# Altium project LimeSDR-XTRX_1v2.PrjPcb (part 5 of 9)
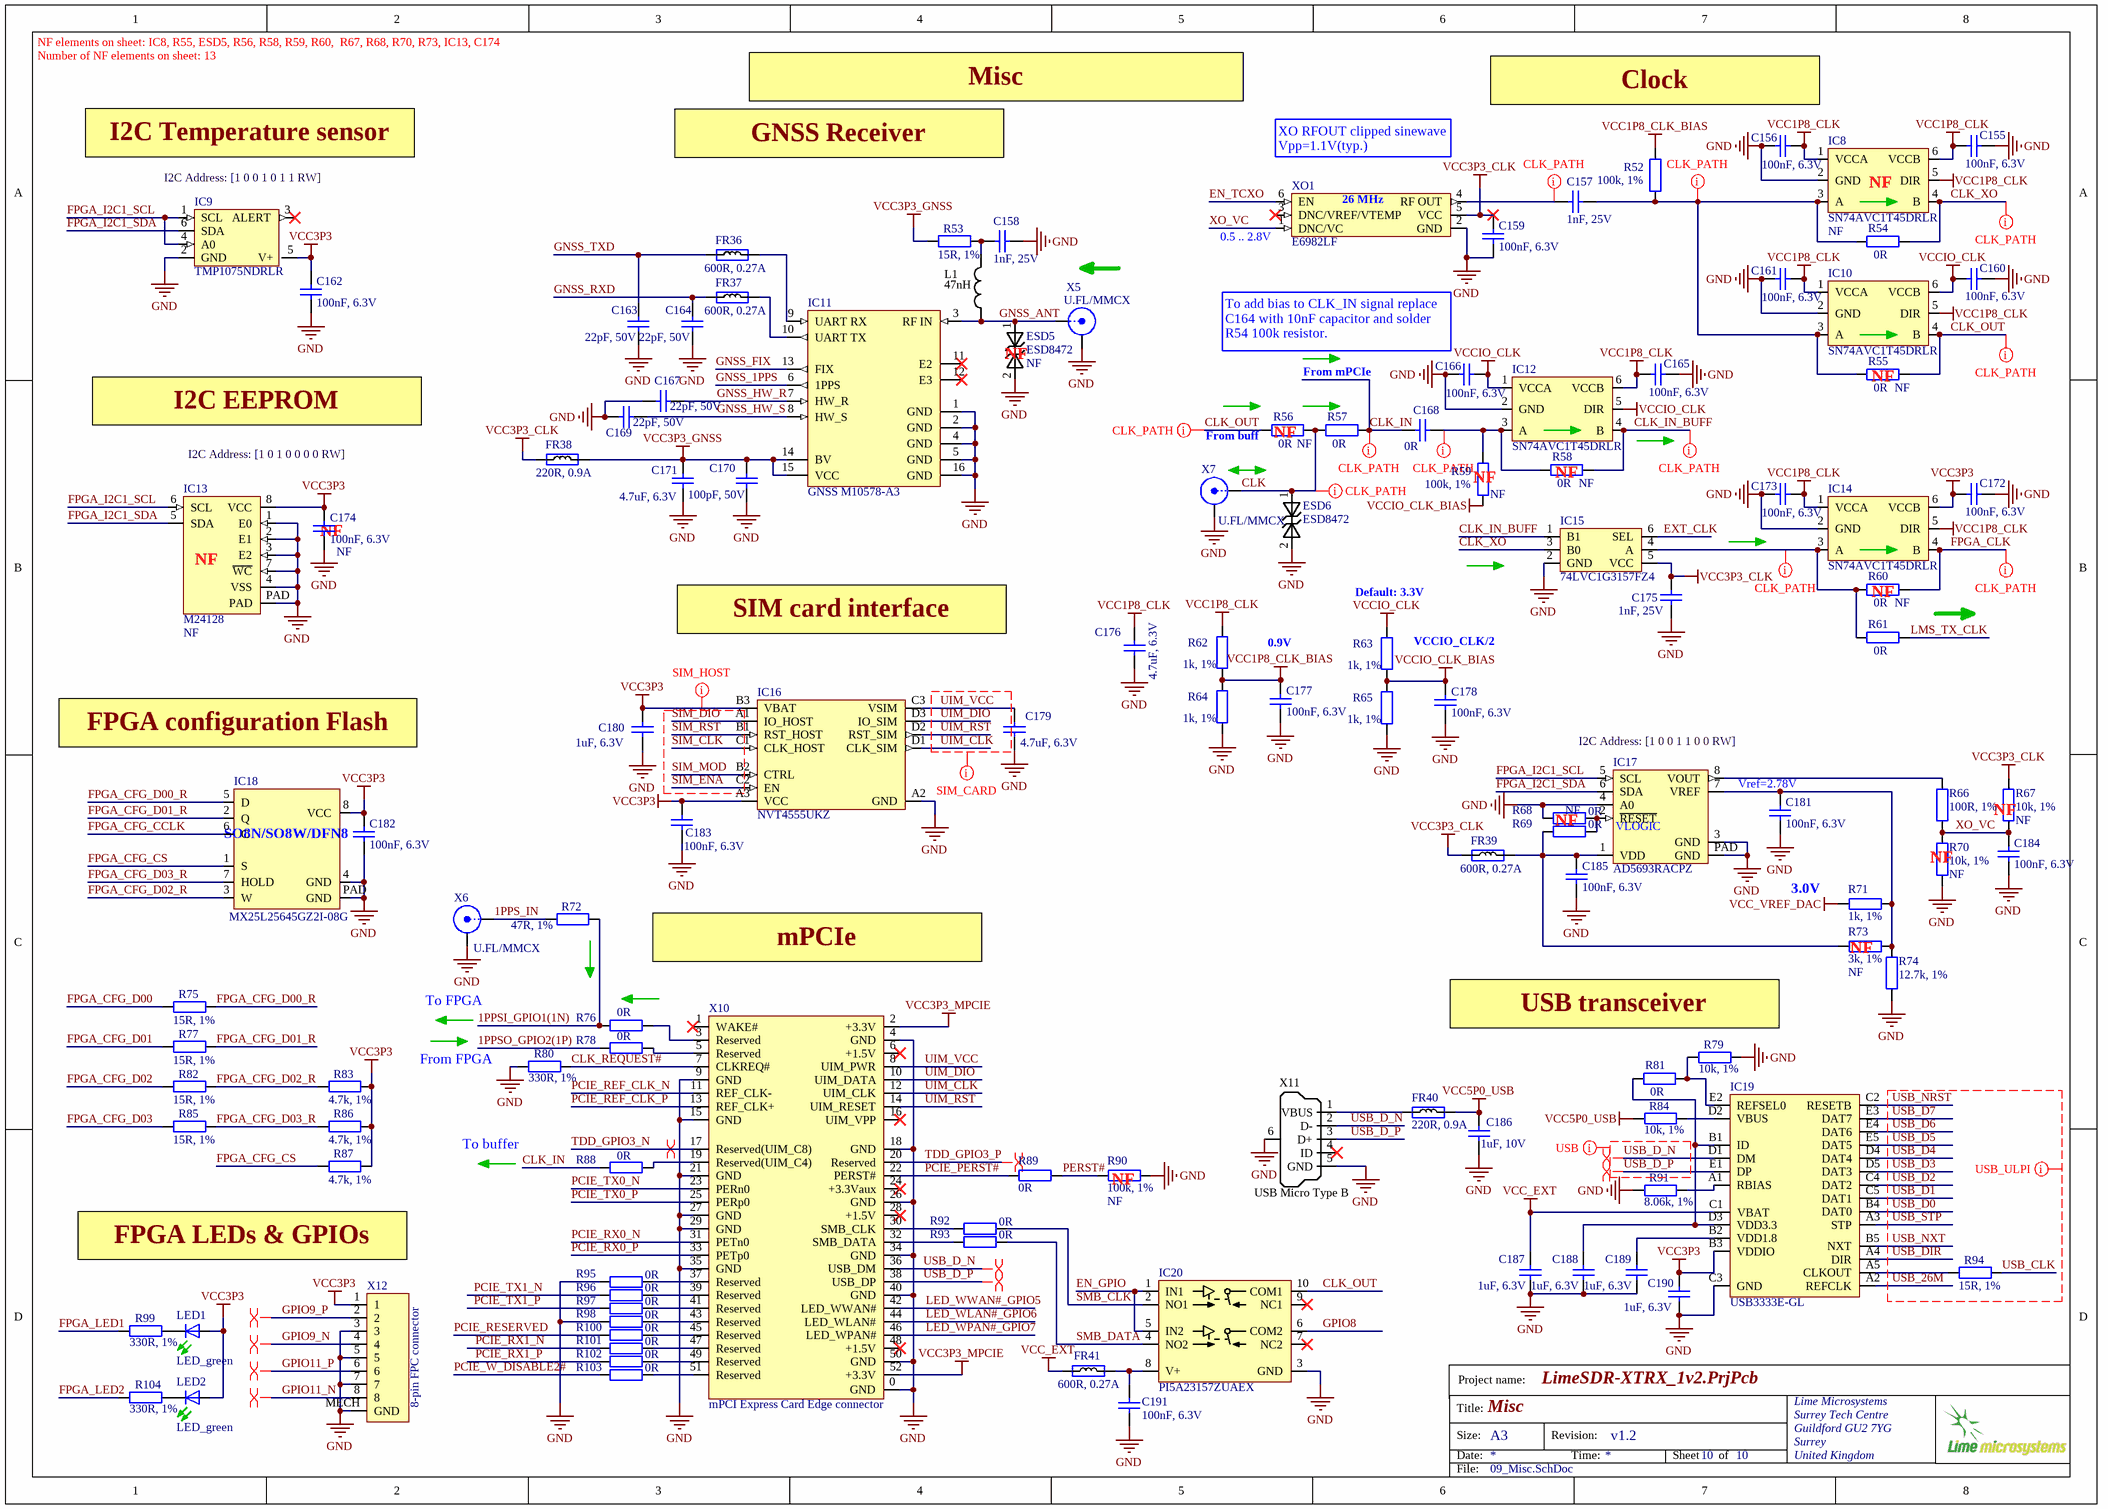
[diagram p109: 09_Misc.SchDoc]

## Sheet 09_Misc.SchDoc: Misc (continued)

### Nets
GND: C155.2 C156.1 C158.2 C159.2 C160.2 C161.1 C162.2 C163.2 C164.2 C165.2 C166.1 C167.2 C169.2 C170.1 C171.1 C172.2 C173.1 C174.2 C175.1 C176.1 C177.2 C178.2 C179.1 C180.2 C181.2 C182.2 C183.2 C184.2 C185.2 C186.1 C187.2 C188.2 C189.2 C190.2 C191.2 ESD5.2 ESD6.2 IC8.2(GND) IC9.2(GND) IC10.2(GND) IC11.1(GND) IC11.2(GND) IC11.4(GND) IC11.5(GND) IC11.16(GND) IC12.2(GND) IC13.1(E0) IC13.2(E1) IC13.3(E2) IC13.4(VSS) IC13.7(~{WC}) IC13.PAD IC14.2(GND) IC15.2(GND) IC16.A2(GND) IC17.3(GND) IC17.4(A0) IC17.PAD(GND) IC18.4(GND) IC18.PAD(GND) IC19.C3(GND) IC20.3(GND) R64.2 R65.2 R68.1 R70.2 R74.2 R79.1 R80.2 R90.1 R91.2 R95.1 R98.1 X5.2(Y) X6.2(Y) X7.2(Y) X10.0(GND) X10.4(GND) X10.9(GND) X10.15(GND) X10.18(GND) X10.21(GND) X10.26(GND) X10.27(GND) X10.29(GND) X10.34(GND) X10.35(GND) X10.40(GND) X10.50(GND) X11.5(GND) X11.6(Shell) X12.3 X12.5 X12.7 X12.MECH(GND) XO1.2(GND)
VCC1P8_CLK: C155.1 C156.2 C161.2 C165.1 C173.2 C176.2 IC8.1(VCCA) IC8.5(DIR) IC8.6(VCCB) IC10.1(VCCA) IC10.5(DIR) IC12.6(VCCB) IC14.1(VCCA) IC14.5(DIR) R62.1
VCC1P8_CLK_BIAS: C177.1 R52.2 R62.2 R64.1
VCC3P3: C162.1 C172.1 C174.1 C180.1 C182.1 C183.1 C190.1 IC9.5(V+) IC13.8(VCC) IC14.6(VCCB) IC16.A3(VCC) IC16.B3(VBAT) IC18.8(VCC) IC19.B3(VDDIO) LED1.A LED2.A R83.1 R86.1 R87.1 X12.1
VCC3P3_CLK: C159.1 C175.2 FR38.1 FR39.1 IC15.5(VCC) R67.1 XO1.5(VCC)
VCC3P3_GNSS: C170.2 C171.2 FR38.2 IC11.14(BV) IC11.15(VCC) R53.2
VCC3P3_MPCIE: X10.2(+3.3V) X10.52(+3.3V)
VCC5P0_USB: C186.2 FR40.2 R84.2
VCC_EXT: C187.1 FR41.1 IC19.C1(VBAT)
VCC_VREF_DAC: R71.2
VCCIO_CLK: C160.1 C166.2 IC10.6(VCCB) IC12.1(VCCA) IC12.5(DIR) R63.1
VCCIO_CLK_BIAS: C178.1 R59.1 R63.2 R65.1
1PPS_IN: R72.2 X6.1(X)
1PPSI_GPIO1(1N): R72.1 R76.1
1PPSO_GPIO2(1P): R78.1
CLK: ESD6.1 R56.2 R57.1 X7.1(X)
CLK_IN: C168.1 R57.2 R88.1
CLK_IN_BUFF: IC12.4(B) IC15.1(B1) R58.2
CLK_OUT: IC10.4(B) IC20.10(COM1) R55.2 R56.1
CLK_REQUEST#: R80.1 X10.7(CLKREQ#)
CLK_XO: IC8.4(B) IC15.3(B0) R54.2
EN_GPIO: IC20.1(IN1) IC20.5(IN2)
EN_TCXO: XO1.6(EN)
EXT_CLK: IC15.6(SEL)
FPGA_CFG_CCLK: IC18.6(C)
FPGA_CFG_CS: IC18.1(S) R87.2
FPGA_CFG_D00: R75.2
FPGA_CFG_D00_R: IC18.5(D) R75.1
FPGA_CFG_D01: R77.2
FPGA_CFG_D01_R: IC18.2(Q) R77.1
FPGA_CFG_D02: R82.2
FPGA_CFG_D02_R: IC18.3(W) R82.1 R83.2
FPGA_CFG_D03: R85.2
FPGA_CFG_D03_R: IC18.7(HOLD) R85.1 R86.2
FPGA_CLK: IC14.4(B) R60.2
FPGA_I2C1_SCL: IC9.1(SCL) IC9.4(A0) IC13.6(SCL) IC17.5(SCL)
FPGA_I2C1_SDA: IC9.6(SDA) IC13.5(SDA) IC17.6(SDA)
FPGA_LED1: R99.2
FPGA_LED2: R104.2
GNSS_1PPS: IC11.6(1PPS)
GNSS_ANT: ESD5.1 IC11.3(RF_IN) L1.1 X5.1(X)
GNSS_FIX: IC11.13(FIX)
GNSS_HW_R: C167.1 IC11.7(HW_R)
GNSS_HW_S: C169.1 IC11.8(HW_S)
GNSS_RXD: C164.1 FR37.1
GNSS_TXD: C163.1 FR36.1
GPIO8: IC20.6(COM2)
GPIO9_N: X12.4
GPIO9_P: X12.2
GPIO11_N: X12.8
GPIO11_P: X12.6
LED_WLAN#_GPIO6: X10.44(LED_WLAN#)
LED_WPAN#_GPIO7: X10.46(LED_WPAN#)
LED_WWAN#_GPIO5: X10.42(LED_WWAN#)
LMS_TX_CLK: R61.2
PCIE_PERST#: R89.1 X10.22(PERST#)
PCIE_REF_CLK_N: X10.11(REF_CLK-)
PCIE_REF_CLK_P: X10.13(REF_CLK+)
PCIE_RESERVED: R100.1
PCIE_RX0_N: X10.31(PETn0)
PCIE_RX0_P: X10.33(PETp0)
PCIE_RX1_N: R101.1
PCIE_RX1_P: R102.1
PCIE_TX0_N: X10.23(PERn0)
PCIE_TX0_P: X10.25(PERp0)
PCIE_TX1_N: R96.1
PCIE_TX1_P: R97.1
PCIE_W_DISABLE2#: R103.1
PERST#: R89.2 R90.2
SIM_CLK: IC16.C1(CLK_HOST)
SIM_DIO: IC16.A1(IO_HOST)
SIM_ENA: IC16.C2(EN)
SIM_MOD: IC16.B2(CTRL)
SIM_RST: IC16.B1(RST_HOST)
SMB_CLK: IC20.2(NO1) R92.2
SMB_DATA: IC20.4(NO2) R93.2
TDD_GPIO3_N: X10.17(Reserved(UIM_C8))
TDD_GPIO3_P: X10.20(Reserved)
UIM_CLK: IC16.D1(CLK_SIM) X10.12(UIM_CLK)
UIM_DIO: IC16.D3(IO_SIM) X10.10(UIM_DATA)
UIM_RST: IC16.D2(RST_SIM) X10.14(UIM_RESET)
UIM_VCC: C179.2 IC16.C3(VSIM) X10.8(UIM_PWR)
USB_26M: IC19.A2(REFCLK)
USB_CLK: R94.1
USB_D0: IC19.B4(DAT0)
USB_D1: IC19.C5(DAT1)
USB_D2: IC19.C4(DAT2)
USB_D3: IC19.D5(DAT3)
USB_D4: IC19.D4(DAT4)
USB_D5: IC19.E5(DAT5)
USB_D6: IC19.E4(DAT6)
USB_D7: IC19.E3(DAT7)
USB_D_N: IC19.D1(DM) X10.36(USB_DM) X11.2(D-)
USB_D_P: IC19.E1(DP) X10.38(USB_DP) X11.3(D+)
USB_DIR: IC19.A4(DIR)
USB_NRST: IC19.C2(RESETB)
USB_NXT: IC19.B5(NXT)
USB_STP: IC19.A3(STP)
XO_VC: C184.1 R66.2 R67.2 R70.1 XO1.1(DNC/VC)
NetC157_1: C157.1 XO1.4(RF_OUT)
NetC157_2: C157.2 IC8.3(A) IC10.3(A) R52.1 R54.1 R55.1
NetC158_1: C158.1 L1.2 R53.1
NetC168_2: C168.2 IC12.3(A) R58.1 R59.2
NetC181_1: C181.1 IC17.7(VREF) R71.1 R73.1 R74.1
NetC185_1: C185.1 FR39.2 IC17.1(VDD) R69.1 R73.2
NetC188_1: C188.1 IC19.B1(ID) IC19.D3(VDD3.3) R81.1
NetC189_1: C189.1 IC19.B2(VDD1.8)
NetC191_1: C191.1 FR41.2 IC20.8(V+)
NetFR36_2: FR36.2 IC11.9(UART_RX)
NetFR37_2: FR37.2 IC11.10(UART_TX)
NetFR40_1: FR40.1 X11.1(VBUS)
NetIC14_3: IC14.3(A) IC15.4(A) R60.1 R61.1
NetIC17_2: IC17.2(~{RESET}) R68.2 R69.2
NetIC17_8: IC17.8(VOUT) R66.1
NetIC19_A1: IC19.A1(RBIAS) R91.1
NetIC19_A5: IC19.A5(CLKOUT) R94.2
NetIC19_D2: IC19.D2(VBUS) R84.1
NetIC19_E2: IC19.E2(REFSEL0) R79.2 R81.2
NetLED1_K: LED1.K(C) R99.1
NetLED2_K: LED2.K(C) R104.1
NetR76_2: R76.2 X10.3(Reserved)
NetR78_2: R78.2 X10.5(Reserved)
NetR88_2: R88.2 X10.19(Reserved(UIM_C4))
NetR92_1: R92.1 X10.30(SMB_CLK)
NetR93_1: R93.1 X10.32(SMB_DATA)
NetR95_2: R95.2 X10.37(Reserved)
NetR96_2: R96.2 X10.39(Reserved)
NetR97_2: R97.2 X10.41(Reserved)
NetR98_2: R98.2 X10.43(Reserved)
NetR100_2: R100.2 X10.45(Reserved)
NetR101_2: R101.2 X10.47(Reserved)
NetR102_2: R102.2 X10.49(Reserved)
NetR103_2: R103.2 X10.51(Reserved)

Not connected (* = marked no-connect by the designer): IC9 3(ALERT)*; IC11 11(E2)* 12(E3)*; IC20 7(NC2)* 9(NC1)*; X10 1(WAKE#)* 6(+1.5V)* 16(UIM_VPP)* 24(+3.3Vaux)* 28(+1.5V)* 48(+1.5V)*; X11 4(ID)*; XO1 3(DNC/VREF/VTEMP)*

### Layout directives
net class SIM_HOST: SIM_CLK, SIM_DIO, SIM_ENA, SIM_MOD, SIM_RST
net class SIM_CARD: UIM_CLK, UIM_DIO, UIM_RST, UIM_VCC
differential pair: GPIO9_N, GPIO9_P, GPIO11_N, GPIO11_P, TDD_GPIO3_N, TDD_GPIO3_P, USB_D_N, USB_D_P
net class USB: USB_D_N, USB_D_P
net class USB_ULPI: USB_26M, USB_CLK, USB_D0, USB_D1, USB_D2, USB_D3, USB_D4, USB_D5, USB_D6, USB_D7, USB_DIR, USB_NRST, USB_NXT, USB_STP
net class CLK_PATH: CLK, CLK_IN, CLK_IN_BUFF, CLK_OUT, CLK_XO, FPGA_CLK, NetC157_1, NetC157_2, NetC168_2, NetIC14_3

### Notes on the sheet
- NF elements on sheet: IC8, R55, ESD5, R56, R58, R59, R60,  R67, R68, R70, R73, IC13, C174
- Number of NF elements on sheet: 13
- Misc
- Clock
- I2C Temperature sensor
- (near IC9) I2C Address: [1 0 0 1 0 1 1 RW]
- GNSS Receiver
- (near XO1) XO RFOUT clipped sinewave Vpp=1.1V(typ.)
- (near XO1) 0.5 .. 2.8V
- (near XO1) 26 MHz
- (near IC8) NF
- (near ESD5) NF
- (near C166) To add bias to CLK_IN signal replace C164 with 10nF capacitor and solder R54 100k resistor.
- From mPCIe
- (near R55) NF
- I2C EEPROM
- (near R56) From buff
- (near R56) NF
- I2C Address: [1 0 1 0 0 0 0 RW]
- (near R59) NF
- (near R58) NF
- (near IC13) NF
- (near C174) NF
- SIM card interface
- 0.9V
- (near R63) Default: 3.3V
- (near R63) VCCIO_CLK/2
- (near R60) NF
- FPGA configuration Flash
- (near IC17) I2C Address: [1 0 0 1 1 0 0 RW]
- (near C181) Vref=2.78V
- NF
- (near IC17) VLOGIC
- (near R67) NF
- (near R71) 3.0V
- (near R70) NF
- mPCIe
- (near R73) NF
- To FPGA
- (near R79) USB transceiver
- From FPGA
- To buffer
- (near R90) NF
- FPGA LEDs & GPIOs
- Project name:
- Title:
- Size:
- Date:
- A3
- Revision:
- Time:
- Sheet
- of
- File:
- (in symbol M25P40_with_pad) SO8N/SO8W/DFN8